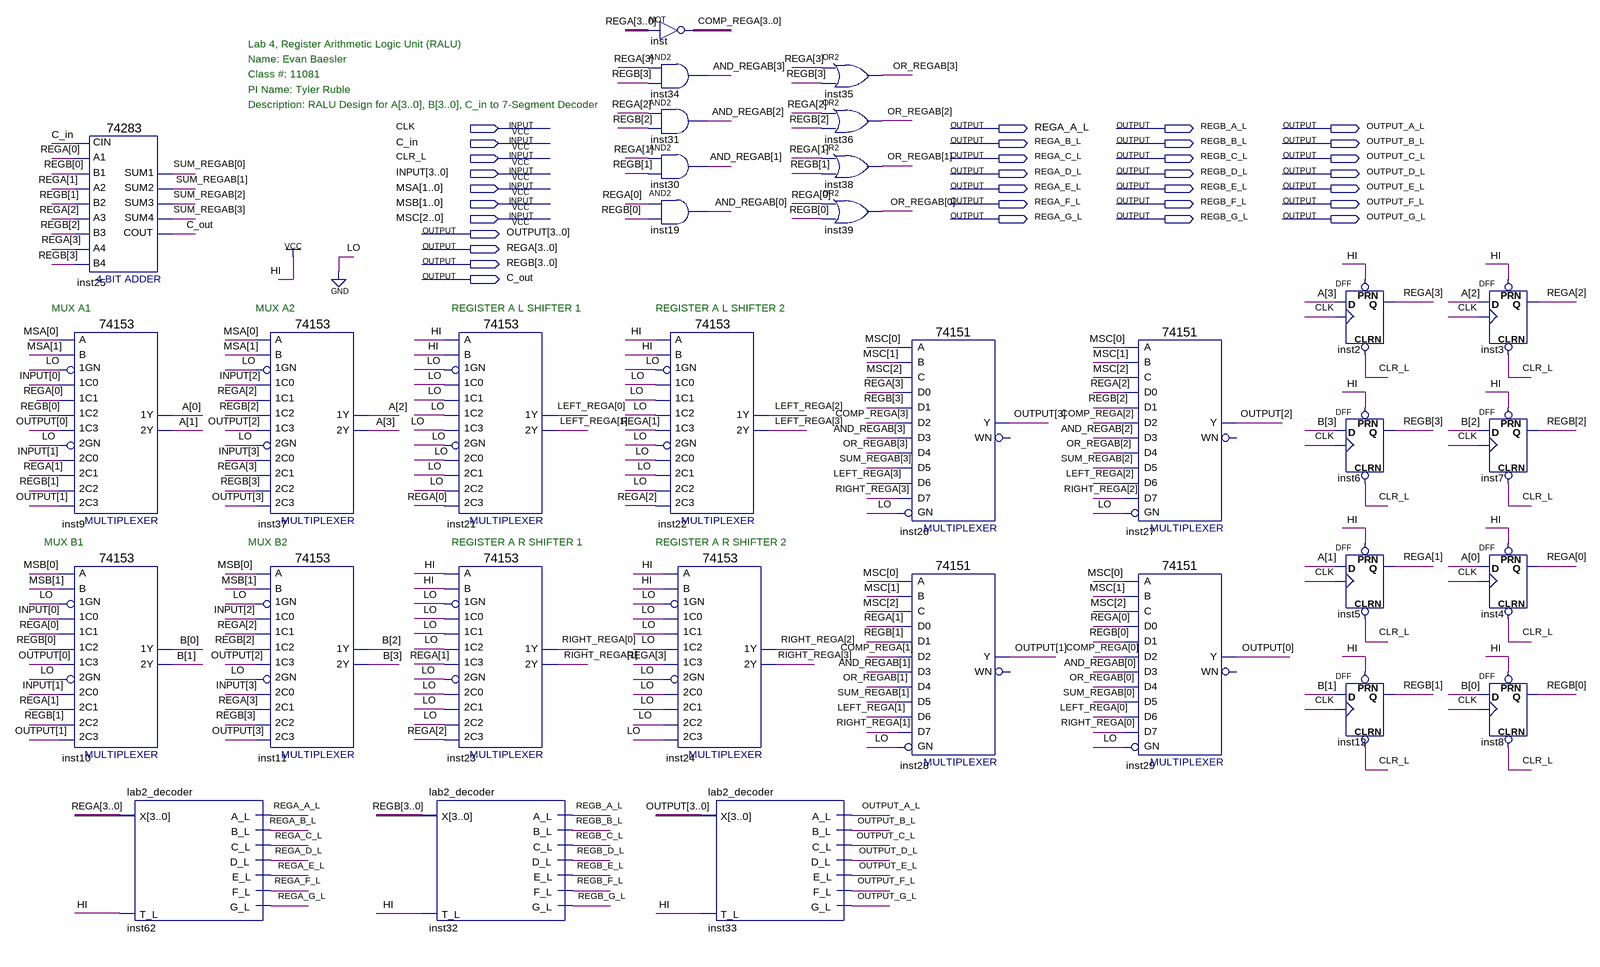
[diagram p0: schematic sheet]
// Quartus schematic lab4_RALU.bdf as structural Verilog: 33 symbols, 32 pins
module lab4_RALU (
  input  CLK,
  input  C_in,
  input  CLR_L,
  input  [3:0] INPUT,
  input  [1:0] MSA,
  input  [1:0] MSB,
  input  [2:0] MSC,
  output REGA_A_L,
  output REGB_A_L,
  output OUTPUT_A_L,
  output REGA_B_L,
  output REGB_B_L,
  output OUTPUT_B_L,
  output REGA_C_L,
  output REGB_C_L,
  output OUTPUT_C_L,
  output REGA_D_L,
  output REGB_D_L,
  output OUTPUT_D_L,
  output REGA_E_L,
  output REGB_E_L,
  output OUTPUT_E_L,
  output REGA_F_L,
  output REGB_F_L,
  output OUTPUT_F_L,
  output REGA_G_L,
  output REGB_G_L,
  output OUTPUT_G_L,
  output [3:0] OUTPUT,
  output [3:0] REGA,
  output [3:0] REGB,
  output C_out
);

  wire [3:0] A, AND_REGAB, B, COMP_REGA, LEFT_REGA, OR_REGAB, RIGHT_REGA, SUM_REGAB;

  \74283  inst25 (
    .CIN(C_in), .A1(REGA[0]), .A2(REGA[1]), .B2(REGB[1]), .A3(REGA[2]), .A4(REGA[3]), .B4(REGB[3]),
    .B1(REGB[0]), .B3(REGB[2]), .SUM4(SUM_REGAB[3]), .COUT(C_out), .SUM1(SUM_REGAB[0]), .SUM2(SUM_REGAB[1]),
    .SUM3(SUM_REGAB[2]));
  \74153  inst9 (
    .\1C1 (REGA[0]), .\1GN (1'b0), .\1C0 (INPUT[0]), .\2C0 (INPUT[1]), .\2GN (1'b0), .\2C2 (REGB[1]),
    .\1C2 (REGB[0]), .\1C3 (OUTPUT[0]), .B(MSA[1]), .A(MSA[0]), .\2C1 (REGA[1]), .\2C3 (OUTPUT[1]),
    .\1Y (A[0]), .\2Y (A[1]));
  \74153  inst10 (
    .\1C1 (REGA[0]), .\1GN (1'b0), .\1C0 (INPUT[0]), .\2C0 (INPUT[1]), .\2GN (1'b0), .\2C2 (REGB[1]),
    .\1C2 (REGB[0]), .\1C3 (OUTPUT[0]), .B(MSB[1]), .A(MSB[0]), .\2C1 (REGA[1]), .\2C3 (OUTPUT[1]),
    .\1Y (B[0]), .\2Y (B[1]));
  lab2_decoder inst62 (
    .X(REGA), .T_L(1'b1), .C_L(REGA_C_L), .D_L(REGA_D_L), .A_L(REGA_A_L), .E_L(REGA_E_L), .B_L(REGA_B_L),
    .F_L(REGA_F_L), .G_L(REGA_G_L));
  \74153  inst37 (
    .\1C1 (REGA[2]), .\1GN (1'b0), .\1C0 (INPUT[2]), .\2C0 (INPUT[3]), .\2GN (1'b0), .\2C2 (REGB[3]),
    .\1C2 (REGB[2]), .\1C3 (OUTPUT[2]), .B(MSA[1]), .A(MSA[0]), .\2C1 (REGA[3]), .\2C3 (OUTPUT[3]),
    .\1Y (A[2]), .\2Y (A[3]));
  \74153  inst11 (
    .\1C1 (REGA[2]), .\1GN (1'b0), .\1C0 (INPUT[2]), .\2C0 (INPUT[3]), .\2GN (1'b0), .\2C2 (REGB[3]),
    .\1C2 (REGB[2]), .\1C3 (OUTPUT[2]), .B(MSB[1]), .A(MSB[0]), .\2C1 (REGA[3]), .\2C3 (OUTPUT[3]),
    .\1Y (B[2]), .\2Y (B[3]));
  \74153  inst21 (
    .\1C1 (1'b0), .\1GN (1'b0), .\1C0 (1'b0), .\2C0 (1'b0), .\2GN (1'b0), .\2C2 (1'b0), .\1C2 (1'b0),
    .\1C3 (1'b0), .B(1'b1), .A(1'b1), .\2C1 (1'b0), .\2C3 (REGA[0]), .\1Y (LEFT_REGA[0]), .\2Y (LEFT_REGA[1]));
  \74153  inst23 (
    .\1C1 (1'b0), .\1GN (1'b0), .\1C0 (1'b0), .\2C0 (1'b0), .\2GN (1'b0), .\2C2 (1'b0), .\1C2 (1'b0),
    .\1C3 (REGA[1]), .B(1'b1), .A(1'b1), .\2C1 (1'b0), .\2C3 (REGA[2]), .\1Y (RIGHT_REGA[0]),
    .\2Y (RIGHT_REGA[1]));
  lab2_decoder inst32 (
    .X(REGB), .T_L(1'b1), .C_L(REGB_C_L), .D_L(REGB_D_L), .A_L(REGB_A_L), .E_L(REGB_E_L), .B_L(REGB_B_L),
    .F_L(REGB_F_L), .G_L(REGB_G_L));
  assign COMP_REGA = ~REGA;  // NOT inst, 4 bits wide
  and inst34 (AND_REGAB[3], REGA[3], REGB[3]);
  and inst31 (AND_REGAB[2], REGA[2], REGB[2]);
  and inst30 (AND_REGAB[1], REGA[1], REGB[1]);
  and inst19 (AND_REGAB[0], REGA[0], REGB[0]);
  \74153  inst22 (
    .\1C1 (1'b0), .\1GN (1'b0), .\1C0 (1'b0), .\2C0 (1'b0), .\2GN (1'b0), .\2C2 (1'b0), .\1C2 (1'b0),
    .\1C3 (REGA[1]), .B(1'b1), .A(1'b1), .\2C1 (1'b0), .\2C3 (REGA[2]), .\1Y (LEFT_REGA[2]),
    .\2Y (LEFT_REGA[3]));
  \74153  inst24 (
    .\1C1 (1'b0), .\1GN (1'b0), .\1C0 (1'b0), .\2C0 (1'b0), .\2GN (1'b0), .\2C2 (1'b0), .\1C2 (1'b0),
    .\1C3 (REGA[3]), .B(1'b1), .A(1'b1), .\2C1 (1'b0), .\2C3 (1'b0), .\1Y (RIGHT_REGA[2]),
    .\2Y (RIGHT_REGA[3]));
  lab2_decoder inst33 (
    .X(OUTPUT), .T_L(1'b1), .C_L(OUTPUT_C_L), .D_L(OUTPUT_D_L), .A_L(OUTPUT_A_L), .E_L(OUTPUT_E_L),
    .B_L(OUTPUT_B_L), .F_L(OUTPUT_F_L), .G_L(OUTPUT_G_L));
  or inst35 (OR_REGAB[3], REGA[3], REGB[3]);
  or inst36 (OR_REGAB[2], REGA[2], REGB[2]);
  or inst38 (OR_REGAB[1], REGA[1], REGB[1]);
  or inst39 (OR_REGAB[0], REGA[0], REGB[0]);
  \74151  inst26 (
    .GN(1'b0), .C(MSC[2]), .B(MSC[1]), .A(MSC[0]), .D5(SUM_REGAB[3]), .D0(REGA[3]), .D1(REGB[3]),
    .D4(OR_REGAB[3]), .D3(AND_REGAB[3]), .D2(COMP_REGA[3]), .D6(LEFT_REGA[3]), .D7(RIGHT_REGA[3]),
    .Y(OUTPUT[3]));  // open: WN
  \74151  inst28 (
    .GN(1'b0), .C(MSC[2]), .B(MSC[1]), .A(MSC[0]), .D5(SUM_REGAB[1]), .D0(REGA[1]), .D1(REGB[1]),
    .D4(OR_REGAB[1]), .D3(AND_REGAB[1]), .D2(COMP_REGA[1]), .D6(LEFT_REGA[1]), .D7(RIGHT_REGA[1]),
    .Y(OUTPUT[1]));  // open: WN
  \74151  inst27 (
    .GN(1'b0), .C(MSC[2]), .B(MSC[1]), .A(MSC[0]), .D5(SUM_REGAB[2]), .D0(REGA[2]), .D1(REGB[2]),
    .D4(OR_REGAB[2]), .D3(AND_REGAB[2]), .D2(COMP_REGA[2]), .D6(LEFT_REGA[2]), .D7(RIGHT_REGA[2]),
    .Y(OUTPUT[2]));  // open: WN
  \74151  inst29 (
    .GN(1'b0), .C(MSC[2]), .B(MSC[1]), .A(MSC[0]), .D5(SUM_REGAB[0]), .D0(REGA[0]), .D1(REGB[0]),
    .D4(OR_REGAB[0]), .D3(AND_REGAB[0]), .D2(COMP_REGA[0]), .D6(LEFT_REGA[0]), .D7(RIGHT_REGA[0]),
    .Y(OUTPUT[0]));  // open: WN
  DFF inst2 (.CLRN(CLR_L), .CLK(CLK), .D(A[3]), .PRN(1'b1), .Q(REGA[3]));
  DFF inst6 (.CLRN(CLR_L), .CLK(CLK), .D(B[3]), .PRN(1'b1), .Q(REGB[3]));
  DFF inst5 (.CLRN(CLR_L), .CLK(CLK), .D(A[1]), .PRN(1'b1), .Q(REGA[1]));
  DFF inst12 (.CLRN(CLR_L), .CLK(CLK), .D(B[1]), .PRN(1'b1), .Q(REGB[1]));
  DFF inst3 (.CLRN(CLR_L), .CLK(CLK), .D(A[2]), .PRN(1'b1), .Q(REGA[2]));
  DFF inst7 (.CLRN(CLR_L), .CLK(CLK), .D(B[2]), .PRN(1'b1), .Q(REGB[2]));
  DFF inst4 (.CLRN(CLR_L), .CLK(CLK), .D(A[0]), .PRN(1'b1), .Q(REGA[0]));
  DFF inst8 (.CLRN(CLR_L), .CLK(CLK), .D(B[0]), .PRN(1'b1), .Q(REGB[0]));

  // Notes on the sheet:
  //   Lab 4, Register Arithmetic Logic Unit (RALU)
  //   Name: Evan Baesler
  //   Class #: 11081
  //   PI Name: Tyler Ruble
  //   Description: RALU Design for A[3..0], B[3..0], C_in to 7-Segment Decoder
  //   MUX A1
  //   MUX A2
  //   REGISTER A L SHIFTER 1
  //   REGISTER A L SHIFTER 2
  //   MUX B1
  //   MUX B2
  //   REGISTER A R SHIFTER 1
  //   REGISTER A R SHIFTER 2
endmodule
